# EAGLE design sensor dan converter (EAGLE 9.6.0)
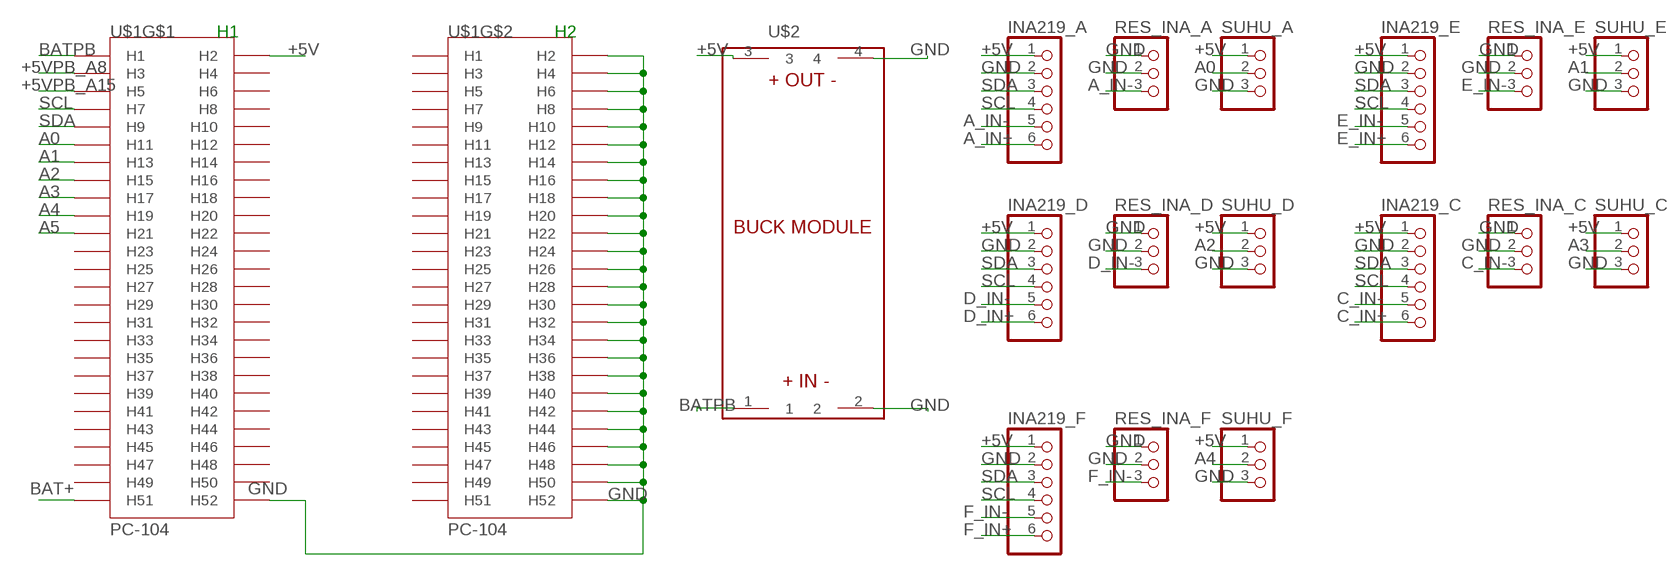
[diagram p0: schematic, sheet 1]

## Parts
INA219_A  PINHD-1X6  [1X06]
INA219_C  PINHD-1X6  [1X06]
INA219_D  PINHD-1X6  [1X06]
INA219_E  PINHD-1X6  [1X06]
INA219_F  PINHD-1X6  [1X06]
RES_INA_A  PINHD-1X3  [1X03]
RES_INA_C  PINHD-1X3  [1X03]
RES_INA_D  PINHD-1X3  [1X03]
RES_INA_E  PINHD-1X3  [1X03]
RES_INA_F  PINHD-1X3  [1X03]
SUHU_A  PINHD-1X3  [1X03]
SUHU_C  PINHD-1X3  [1X03]
SUHU_D  PINHD-1X3  [1X03]
SUHU_E  PINHD-1X3  [1X03]
SUHU_F  PINHD-1X3  [1X03]
U$1  PC-104  [PC-104]
U$2  BUCK_MODULEWITH_SMDPADS&THROUGHHOLES  [BUCK_MODULE]

## Nets
+5V: INA219_A.1 INA219_C.1 INA219_D.1 INA219_E.1 INA219_F.1 SUHU_A.1 SUHU_C.1 SUHU_D.1 SUHU_E.1 SUHU_F.1 U$1.P$2(H2) U$2.3
+5VPB_A8: U$1.P$3(H3)
+5VPB_A15: U$1.P$5(H5)
A0: SUHU_A.2 U$1.P$11(H11)
A1: SUHU_E.2 U$1.P$13(H13)
A2: SUHU_D.2 U$1.P$15(H15)
A3: SUHU_C.2 U$1.P$17(H17)
A4: SUHU_F.2 U$1.P$19(H19)
A5: U$1.P$21(H21)
A_IN+: INA219_A.6
A_IN-: INA219_A.5 RES_INA_A.3
BAT+: U$1.P$51(H51)
BATPB: U$1.P$1(H1) U$2.1
C_IN+: INA219_C.6
C_IN-: INA219_C.5 RES_INA_C.3
D_IN+: INA219_D.6
D_IN-: INA219_D.5 RES_INA_D.3
E_IN+: INA219_E.6
E_IN-: INA219_E.5 RES_INA_E.3
F_IN+: INA219_F.6
F_IN-: INA219_F.5 RES_INA_F.3
GND [GND]: INA219_A.2 INA219_C.2 INA219_D.2 INA219_E.2 INA219_F.2 RES_INA_A.1 RES_INA_A.2 RES_INA_C.1 RES_INA_C.2 RES_INA_D.1 RES_INA_D.2 RES_INA_E.1 RES_INA_E.2 RES_INA_F.1 RES_INA_F.2 SUHU_A.3 SUHU_C.3 SUHU_D.3 SUHU_E.3 SUHU_F.3 U$1.P$52(H52) U$1.P$54(H2) U$1.P$56(H4) U$1.P$58(H6) U$1.P$60(H8) U$1.P$62(H10) U$1.P$64(H12) U$1.P$66(H14) U$1.P$68(H16) U$1.P$70(H18) U$1.P$72(H20) U$1.P$74(H22) U$1.P$76(H24) U$1.P$78(H26) U$1.P$80(H28) U$1.P$82(H30) U$1.P$84(H32) U$1.P$86(H34) U$1.P$88(H36) U$1.P$90(H38) U$1.P$92(H40) U$1.P$94(H42) U$1.P$96(H44) U$1.P$98(H46) U$1.P$100(H48) U$1.P$102(H50) U$1.P$104(H52) U$2.2 U$2.4
SCL: INA219_A.4 INA219_C.4 INA219_D.4 INA219_E.4 INA219_F.4 U$1.P$7(H7)
SDA: INA219_A.3 INA219_C.3 INA219_D.3 INA219_E.3 INA219_F.3 U$1.P$9(H9)
Unconnected: U$1.P$4(H4) U$1.P$6(H6) U$1.P$8(H8) U$1.P$10(H10) U$1.P$12(H12) U$1.P$14(H14) U$1.P$16(H16) U$1.P$18(H18) U$1.P$20(H20) U$1.P$22(H22) U$1.P$23(H23) U$1.P$24(H24) U$1.P$25(H25) U$1.P$26(H26) U$1.P$27(H27) U$1.P$28(H28) U$1.P$29(H29) U$1.P$30(H30) U$1.P$31(H31) U$1.P$32(H32) U$1.P$33(H33) U$1.P$34(H34) U$1.P$35(H35) U$1.P$36(H36) U$1.P$37(H37) U$1.P$38(H38) U$1.P$39(H39) U$1.P$40(H40) U$1.P$41(H41) U$1.P$42(H42) U$1.P$43(H43) U$1.P$44(H44) U$1.P$45(H45) U$1.P$46(H46) U$1.P$47(H47) U$1.P$48(H48) U$1.P$49(H49) U$1.P$50(H50) U$1.P$53(H1) U$1.P$55(H3) U$1.P$57(H5) U$1.P$59(H7) U$1.P$61(H9) U$1.P$63(H11) U$1.P$65(H13) U$1.P$67(H15) U$1.P$69(H17) U$1.P$71(H19) U$1.P$73(H21) U$1.P$75(H23) U$1.P$77(H25) U$1.P$79(H27) U$1.P$81(H29) U$1.P$83(H31) U$1.P$85(H33) U$1.P$87(H35) U$1.P$89(H37) U$1.P$91(H39) U$1.P$93(H41) U$1.P$95(H43) U$1.P$97(H45) U$1.P$99(H47) U$1.P$101(H49) U$1.P$103(H51)

## Notes on the sheet
- H1 | H2

## Library data of the parts
INA219_A INA219_C INA219_D INA219_E INA219_F = adafruit:PINHD-1X6: PIN HEADER
RES_INA_A RES_INA_C RES_INA_D RES_INA_E RES_INA_F SUHU_A SUHU_C SUHU_D SUHU_E SUHU_F = adafruit:PINHD-1X3: PIN HEADER
U$1 = Locana Board:PC-104
U$2 = BUCK_MODULE:BUCK_MODULE

## Net classes
0 default: width 0.203 mm
1 GND: width 0.254 mm

## Board
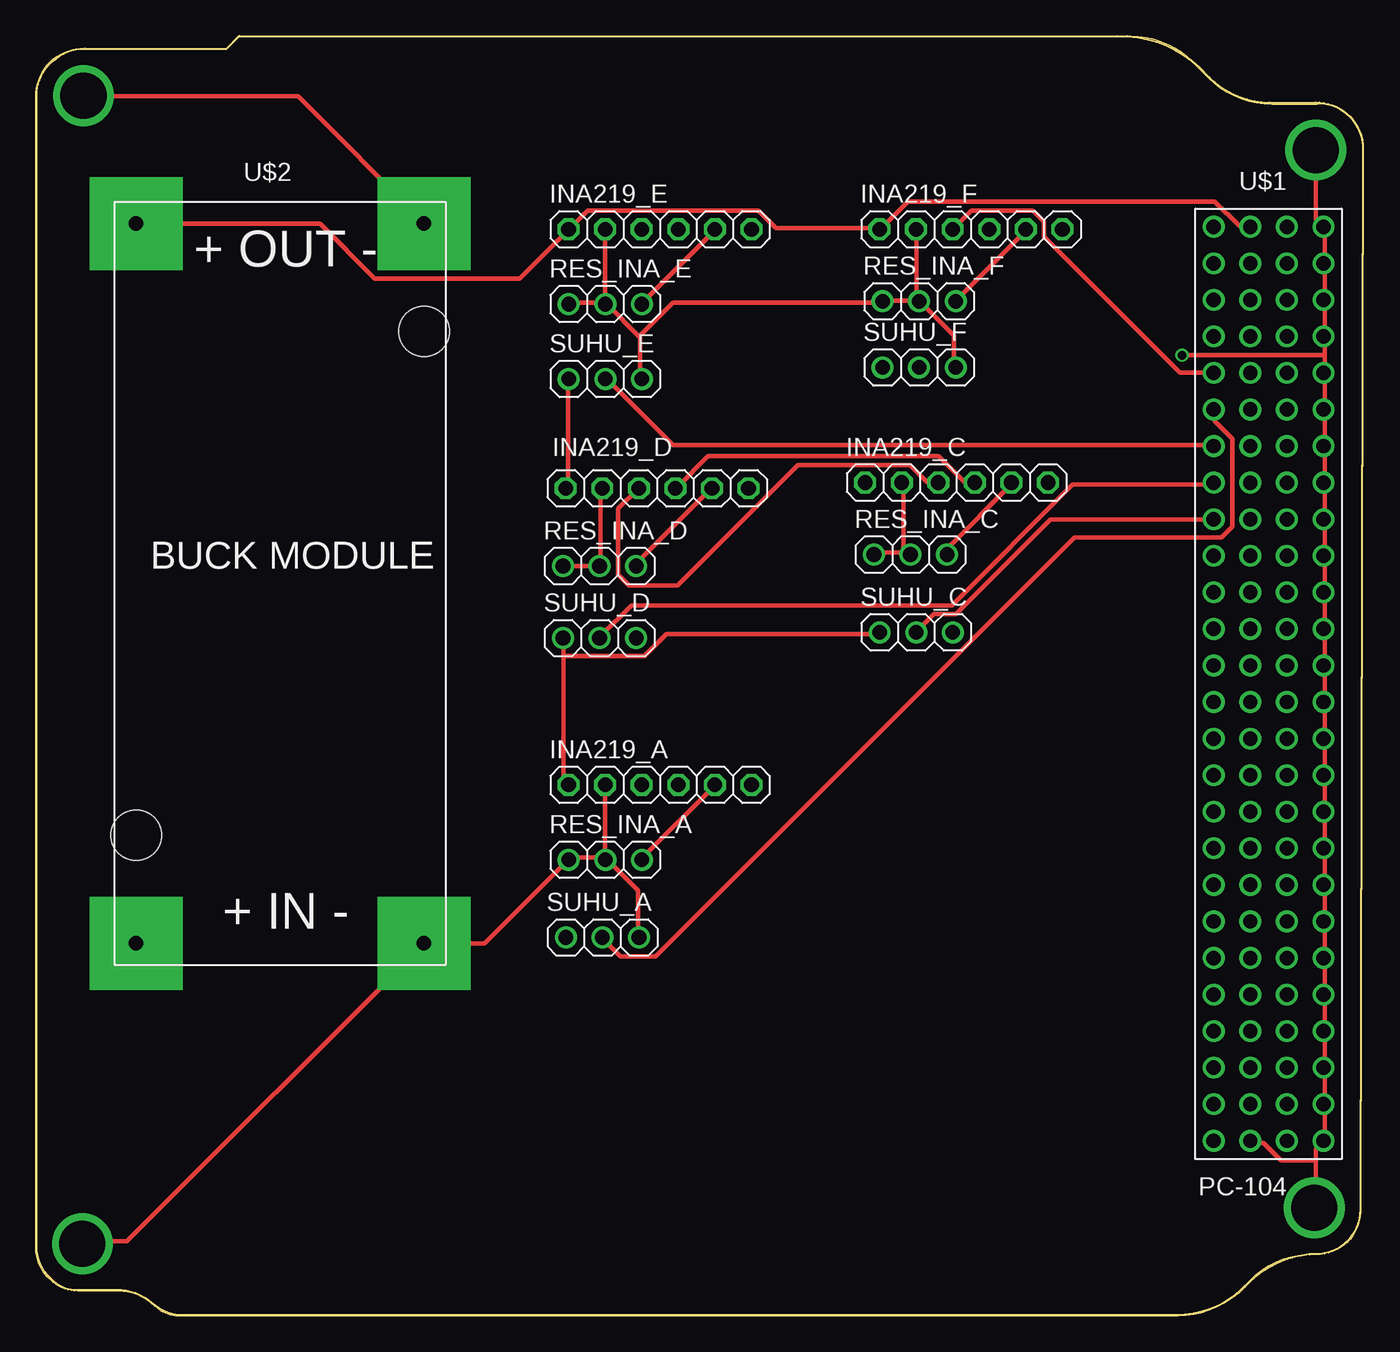
[diagram p1: board, top side]
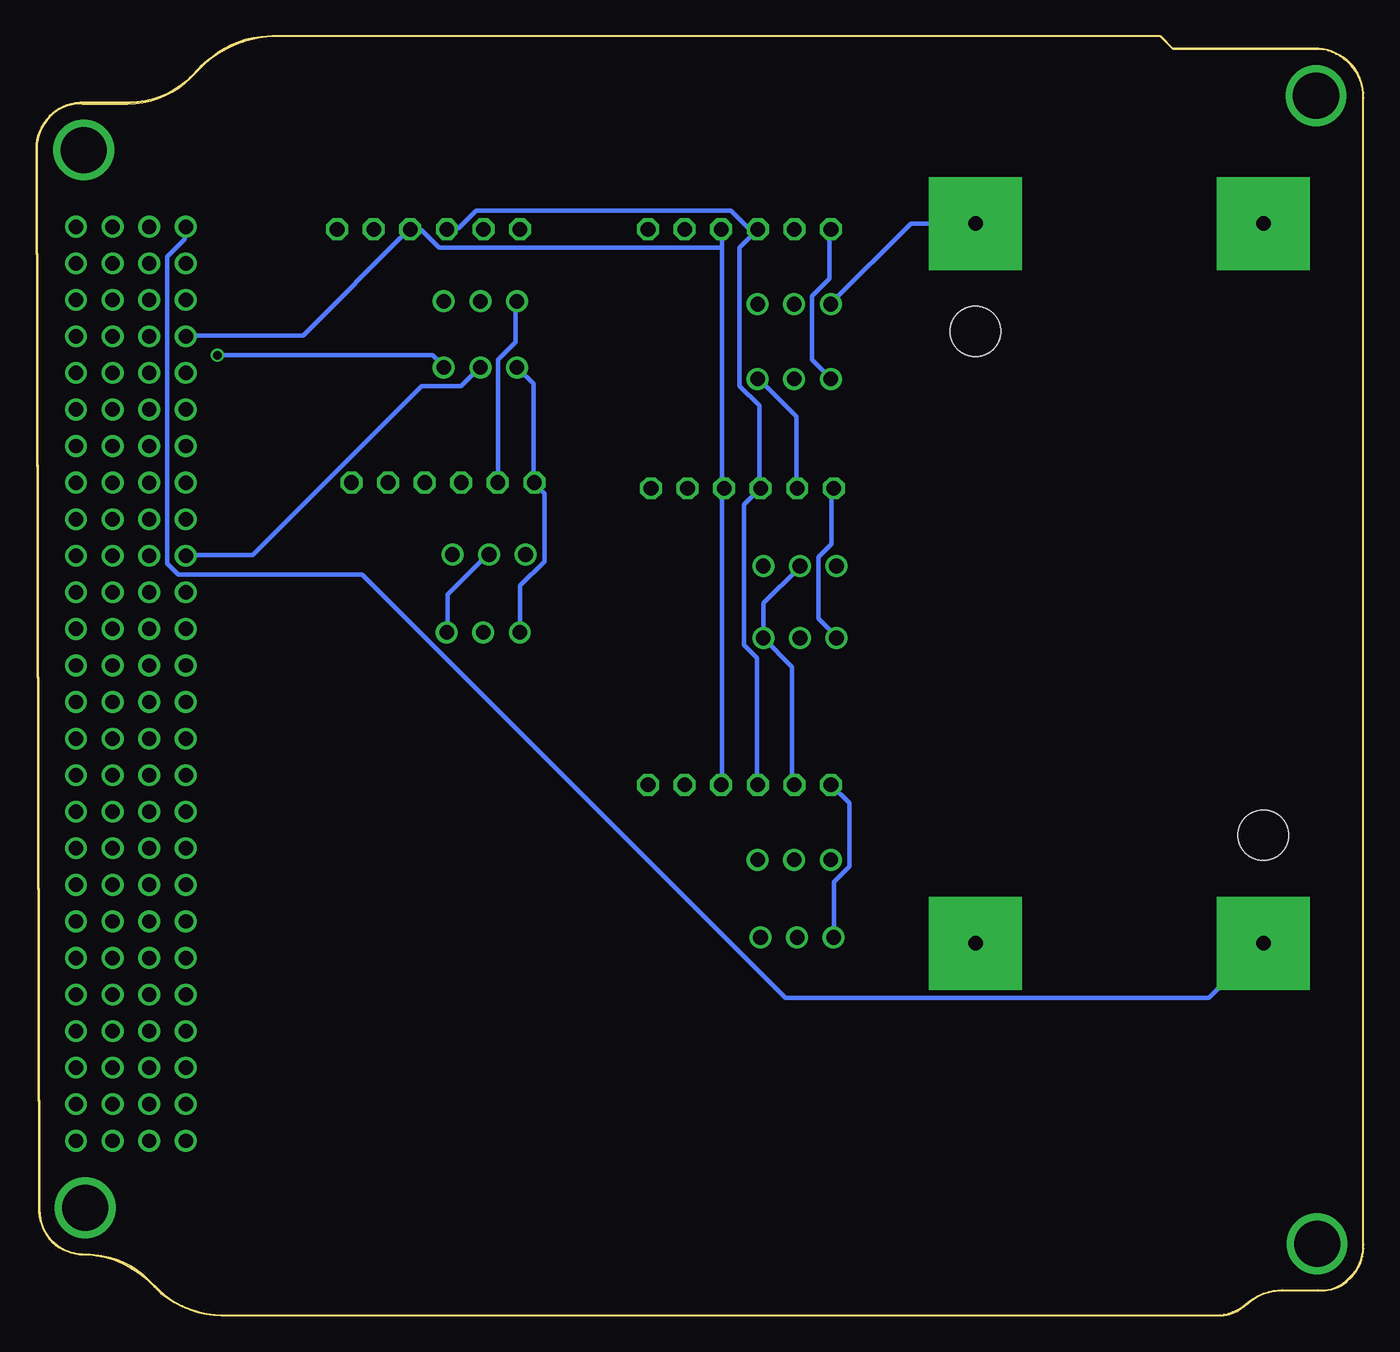
[diagram p2: board, bottom side, seen from below]

Size 92.22 x 88.9 mm. Coordinates in mm from the lower left corner, seen from the top.
Outline: 89.1,84.2 arc-90 92.22,81.05 92.02,7.52 arc-90 89,4.28 88.71,4.28 arc45 84.38,2.48 83.69,1.8 arc-45 79.36,0 9.88,0 arc-40 8.51,0.5 8.37,0.63 arc45 5.71,1.73 3.2,1.73 arc-90 0.05,4.83 0.05,84.83 arc-90 3.17,88 13.22,88 14.1,88.87 76.06,88.87 arc-45 80.39,87.08 81.5,85.97 arc45 85.84,84.18 89.02,84.18
Outline: 0,4.93 0,84.61 arc-90 3.41,88.03 13.25,88.03 14.12,88.9 75.11,88.9 arc-45 80.81,86.72 81.52,86.01 arc45 85.7,84.28 88.88,84.28 arc-90 92.17,81.13 92,7.66 arc-45 91.1,5.13 arc-35 89.21,4.28 89.05,4.28 arc45 84.27,2.3 83.98,2.01 arc-45 79.2,0.03 10.28,0.03 arc-41 8.04,0.87 arc41 5.62,1.78 3.15,1.78 arc-45 1.18,2.34 0.82,2.71 arc-45 0,4.93
Copper layers (1*16): Top 0.035mm / dielectric 1.5mm / Bottom 0.035mm
Design rules "default *": minimum track width 12mil, minimum drill 0.6mm, track to track 12mil, track to pad 12mil, pad to pad 12mil, via to via 12mil, smd to smd 12mil, copper to edge 40mil, drill to drill 12mil, minimum pad ring 10mil, minimum via ring 6mil, stop-mask expansion 4mil, vias tented up to drill 0mil, thermal gap 10mil

### Footprints (pad centres in the part's own frame; a part is rotated, then mirrored left to right if it is on the bottom)
1X06 = drill 1.016 octagon: 1 -6.35,0; 2 -3.81,0; 3 -1.27,0; 4 1.27,0; 5 3.81,0; 6 6.35,0
1X03 = drill 1.016: 1 -2.54,0; 2 0,0; 3 2.54,0
PC-104 = drill 1: P$1 -3.81,31.75; P$2 -1.27,31.75; P$3 -3.81,29.21; P$4 -1.27,29.21; P$5 -3.81,26.67; P$6 -1.27,26.67; P$7 -3.81,24.13; P$8 -1.27,24.13; P$9 -3.81,21.59; P$10 -1.27,21.59; P$11 -3.81,19.05; P$12 -1.27,19.05; P$13 -3.81,16.51; P$14 -1.27,16.51; P$15 -3.81,13.97; P$16 -1.27,13.97; P$17 -3.81,11.43; P$18 -1.27,11.43; P$19 -3.81,8.89; P$20 -1.27,8.89; P$21 -3.81,6.35; P$22 -1.27,6.35; P$23 -3.81,3.81; P$24 -1.27,3.81; P$25 -3.81,1.27; P$26 -1.27,1.27; P$27 -3.81,-1.27; P$28 -1.27,-1.27; P$29 -3.81,-3.81; P$30 -1.27,-3.81; P$31 -3.81,-6.35; P$32 -1.27,-6.35; P$33 -3.81,-8.89; P$34 -1.27,-8.89; P$35 -3.81,-11.43; P$36 -1.27,-11.43; P$37 -3.81,-13.97; P$38 -1.27,-13.97; P$39 -3.81,-16.51; P$40 -1.27,-16.51; P$41 -3.81,-19.05; P$42 -1.27,-19.05; P$43 -3.81,-21.59; P$44 -1.27,-21.59; P$45 -3.81,-24.13; P$46 -1.27,-24.13; P$47 -3.81,-26.67; P$48 -1.27,-26.67; P$49 -3.81,-29.21; P$50 -1.27,-29.21; P$51 -3.81,-31.75; P$52 -1.27,-31.75; P$53 1.27,31.75; P$54 3.81,31.75; P$55 1.27,29.21; P$56 3.81,29.21; P$57 1.27,26.67; P$58 3.81,26.67; P$59 1.27,24.13; P$60 3.81,24.13; P$61 1.27,21.59; P$62 3.81,21.59; P$63 1.27,19.05; P$64 3.81,19.05; P$65 1.27,16.51; P$66 3.81,16.51; P$67 1.27,13.97; P$68 3.81,13.97; P$69 1.27,11.43; P$70 3.81,11.43; P$71 1.27,8.89; P$72 3.81,8.89; P$73 1.27,6.35; P$74 3.81,6.35; P$75 1.27,3.81; P$76 3.81,3.81; P$77 1.27,1.27; P$78 3.81,1.27; P$79 1.27,-1.27; P$80 3.81,-1.27; P$81 1.27,-3.81; P$82 3.81,-3.81; P$83 1.27,-6.35; P$84 3.81,-6.35; P$85 1.27,-8.89; P$86 3.81,-8.89; P$87 1.27,-11.43; P$88 3.81,-11.43; P$89 1.27,-13.97; P$90 3.81,-13.97; P$91 1.27,-16.51; P$92 3.81,-16.51; P$93 1.27,-19.05; P$94 3.81,-19.05; P$95 1.27,-21.59; P$96 3.81,-21.59; P$97 1.27,-24.13; P$98 3.81,-24.13; P$99 1.27,-26.67; P$100 3.81,-26.67; P$101 1.27,-29.21; P$102 3.81,-29.21; P$103 1.27,-31.75; P$104 3.81,-31.75
BUCK_MODULE = drill 1 pad 6.452 square: 1 -10,-25; 2 10,-25; 3 -10,25; 4 10,25 | hole 3.5: -10,-17.5; 10,17.5

### Placement (x,y rotation side)
INA219_A  43.35,36.88 0 top
INA219_C  63.95,57.88 0 top
INA219_D  43.15,57.48 0 top
INA219_E  43.35,75.48 0 top
INA219_F  64.95,75.48 0 top
RES_INA_A  39.55,31.68 0 top
RES_INA_C  60.75,52.88 0 top
RES_INA_D  39.15,52.08 0 top
RES_INA_E  39.55,70.28 0 top
RES_INA_F  61.35,70.48 0 top
SUHU_A  39.35,26.28 0 top
SUHU_C  61.15,47.48 0 top
SUHU_D  39.15,47.08 0 top
SUHU_E  39.55,65.08 0 top
SUHU_F  61.35,65.88 0 top
U$1  85.62,43.9 0 top
U$2  16.95,50.88 0 top

### Tracks (layer width: path | path; a pad name or v marks a point on that pad's centre or on a via)
+5V
  Top 0.305: U$1.P$2 84.34,75.72 83.58,75.72 81.9,77.39 60.57,77.39 58.74,75.56 INA219_F.1 58.59,75.56 51.42,75.56 50.2,76.78 38.32,76.78 37.1,75.56 INA219_E.1 36.94,75.41 33.59,72.06 23.53,72.06 19.72,75.87 7.07,75.87 U$2.3 | INA219_D.1 36.94,57.58 36.94,65.05 SUHU_E.1 | 36.64,45.85 36.64,37.31 36.94,37.01 INA219_A.1 | 36.64,45.85 36.64,47.07 SUHU_D.1 | 36.64,45.85 42.28,45.85 43.8,47.37 58.59,47.37 SUHU_C.1
  Bottom 0.305: SUHU_F.1 58.74,65.81 57.67,64.74 57.67,57.89 INA219_C.1 57.52,57.73 56.91,57.12 56.91,52.4 58.59,50.72 58.59,47.52 SUHU_C.1 | INA219_E.1 37.1,75.41 37.1,72.06 38.32,70.84 38.32,66.42 37.1,65.2 SUHU_E.1 | SUHU_A.1 36.79,26.34 36.79,30.15 35.73,31.22 35.73,35.64 36.94,36.85 INA219_A.1 | INA219_D.1 36.94,57.43 36.94,53.62 37.86,52.7 37.86,48.44 36.64,47.22 SUHU_D.1
A0
  Top 0.305: U$1.P$11 81.9,62.91 81.9,62.15 83.12,60.93 83.12,54.84 82.36,54.08 72.15,54.08 43.04,24.97 40.6,24.97 39.38,26.19 SUHU_A.2
A1
  Top 0.305: U$1.P$13 81.75,60.48 44.26,60.48 39.69,65.05 SUHU_E.2
A2
  Top 0.305: U$1.P$15 81.75,57.73 72,57.73 63.61,49.35 41.36,49.35 39.23,47.22 SUHU_D.2
A3
  Top 0.305: U$1.P$17 81.75,55.29 70.47,55.29 63.92,48.74 62.4,48.74 61.18,47.52 SUHU_C.2
A4
  Bottom 0.305: U$1.P$19 81.75,52.86 77.18,52.86 65.44,64.59 62.7,64.59 61.48,65.81 SUHU_F.2
A_IN-
  Top 0.305: RES_INA_A.3 42.13,31.83 47.16,36.85 INA219_A.5
BATPB
  Bottom 0.305: U$1.P$1 81.9,75.56 81.9,74.8 83.12,73.58 83.12,52.25 82.36,51.48 69.56,51.48 40.14,22.07 10.73,22.07 7.07,25.73 U$2.1
C_IN-
  Top 0.305: RES_INA_C.3 63.31,53.01 63.31,53.31 67.73,57.73 INA219_C.5
D_IN-
  Top 0.305: RES_INA_D.3 41.82,52.09 41.82,52.4 46.85,57.43 INA219_D.5
E_IN-
  Top 0.305: RES_INA_E.3 42.13,70.38 47.16,75.41 INA219_E.5
F_IN-
  Top 0.305: RES_INA_F.3 63.92,70.53 68.8,75.41 INA219_F.5
GND  (via drill 0.6, 3.2)
  Top 0.305: v88.9,80.98 88.91,80.9 88.91,76.17 89.37,75.72 U$1.P$54 89.52,75.56 89.52,73.13 U$1.P$56 89.52,72.97 89.52,70.69 U$1.P$58 89.52,70.53 89.52,68.1 U$1.P$60 89.52,67.94 89.52,66.72 | 89.52,66.72 89.52,65.51 U$1.P$62 89.52,65.35 89.52,63.07 U$1.P$64 89.52,62.91 89.52,60.48 U$1.P$66 89.52,60.32 89.52,57.89 U$1.P$68 89.52,57.73 89.52,55.45 U$1.P$70 89.52,55.29 89.52,52.86 U$1.P$72 89.52,52.7 89.52,50.27 U$1.P$74 89.52,50.11 89.52,47.83 U$1.P$76 89.52,47.67 89.52,45.24 U$1.P$78 89.52,45.08 89.52,42.65 U$1.P$80 89.52,42.49 89.52,40.21 U$1.P$82 89.52,40.05 89.52,37.62 U$1.P$84 89.52,37.46 89.52,35.03 U$1.P$86 89.52,34.87 89.52,32.59 U$1.P$88 89.52,32.43 89.52,30 U$1.P$90 89.52,29.84 89.52,27.41 U$1.P$92 89.52,27.25 89.52,24.97 U$1.P$94 89.52,24.81 89.52,22.38 U$1.P$96 89.52,22.22 89.52,19.79 U$1.P$98 89.52,19.63 89.52,17.35 U$1.P$100 89.52,17.19 89.52,14.76 U$1.P$102 89.52,14.6 89.52,12.17 U$1.P$104 89.37,12.01 88.91,11.56 88.91,10.79 | 88.91,10.79 88.91,7.59 v88.8,7.5 | 88.91,10.79 86.47,10.79 85.25,12.01 84.49,12.01 U$1.P$52 | v3.22,5 3.26,5.16 6.31,5.16 26.89,25.73 U$2.2 27.04,25.88 31.15,25.88 36.94,31.67 RES_INA_A.1 37.1,31.83 39.53,31.83 RES_INA_A.2 | v3.3,84.75 3.42,84.71 18.2,84.71 26.89,76.02 U$2.4 | 61.18,70.53 61.33,70.53 RES_INA_F.2 | 61.18,70.53 58.89,70.53 RES_INA_F.1 58.74,70.38 44.26,70.38 41.9,68.02 | 61.18,70.53 61.18,75.41 INA219_F.2 | 61.18,70.53 RES_INA_F.2 | SUHU_F.3 63.77,65.96 63.77,68.1 61.48,70.38 RES_INA_F.2 | 60.26,53.01 60.72,53.01 RES_INA_C.2 60.26,53.01 | 60.26,53.01 58.28,53.01 RES_INA_C.1
  Top 0.305: 60.26,53.01 60.26,57.73 INA219_C.2 | INA219_A.2 39.53,36.85 39.53,31.98 RES_INA_A.2 | SUHU_A.3 41.82,26.34 41.82,29.54 39.69,31.67 RES_INA_A.2 | RES_INA_D.1 36.64,52.09 39.08,52.09 RES_INA_D.2 39.23,52.09 39.23,57.43 INA219_D.2 | RES_INA_E.1 37.1,70.38 39.53,70.38 RES_INA_E.2 | 41.9,68.02 39.69,70.23 RES_INA_E.2 | 41.9,68.02 41.97,67.94 41.97,65.2 SUHU_E.3 | INA219_E.2 39.53,75.41 39.53,70.53 RES_INA_E.2 | v79.62,66.72 89.52,66.72
  Bottom 0.305: SUHU_C.3 63.61,47.52 63.61,50.11 60.87,52.86 RES_INA_C.2 | RES_INA_F.1 58.89,70.38 58.89,67.64 60.11,66.42 60.11,57.89 INA219_C.2 | RES_INA_D.2 39.23,51.94 41.67,49.5 41.67,47.22 SUHU_D.3 41.67,47.07 39.69,45.08 39.69,37.01 INA219_A.2 | INA219_D.2 39.38,57.58 39.38,62.46 41.97,65.05 SUHU_E.3 | U$2.4 27.04,75.87 31.46,75.87 36.94,70.38 RES_INA_E.1 | v79.62,66.72 64.68,66.72 63.92,65.96 SUHU_F.3
SCL
  Top 0.305: INA219_C.4 65.14,57.89 64.53,57.89 62.7,59.71 46.7,59.71 44.56,57.58 INA219_D.4
  Bottom 0.305: U$1.P$7 81.75,68.1 73.67,68.1 66.36,75.41 INA219_F.4 66.2,75.41 65.44,75.41 64.22,74.19 44.56,74.19 | 44.56,74.19 44.56,75.41 INA219_E.4 | 44.56,74.19 44.56,57.58 INA219_D.4 44.56,57.43 44.56,37.01 INA219_A.4
SDA
  Top 0.305: U$1.P$9 81.75,65.51 79.46,65.51 70.02,74.95 70.02,76.02 69.25,76.78 64.99,76.78 63.77,75.56 INA219_F.3 | INA219_C.3 62.55,57.89 61.94,57.89 60.72,59.1 52.95,59.1 44.56,50.72 41.21,50.72 40.45,51.48 40.45,56.06 41.82,57.43 INA219_D.3
  Bottom 0.305: INA219_A.3 42.13,37.01 42.13,45.69 43.04,46.61 43.04,56.36 41.97,57.43 INA219_D.3 41.97,57.58 41.97,63.22 43.34,64.59 43.34,74.19 42.13,75.41 INA219_E.3 42.43,75.26 43.95,76.78 61.63,76.78 62.85,75.56 63.61,75.56 INA219_F.3

### Text on the board
bTest: VBAT | 5V | SCL | 3.3V | SDA | CAN_HIGH | 5V | GND | 3.3v | SDA | GND | CAN_HIGH | CAN_LOW | GND | SDL | CAN_LOW | 5V
Name: LOCANA + ICU BOARD